# Altium schematic sheet TPS62082.SchDoc
size Letter; Author: FF7 HD Remastered
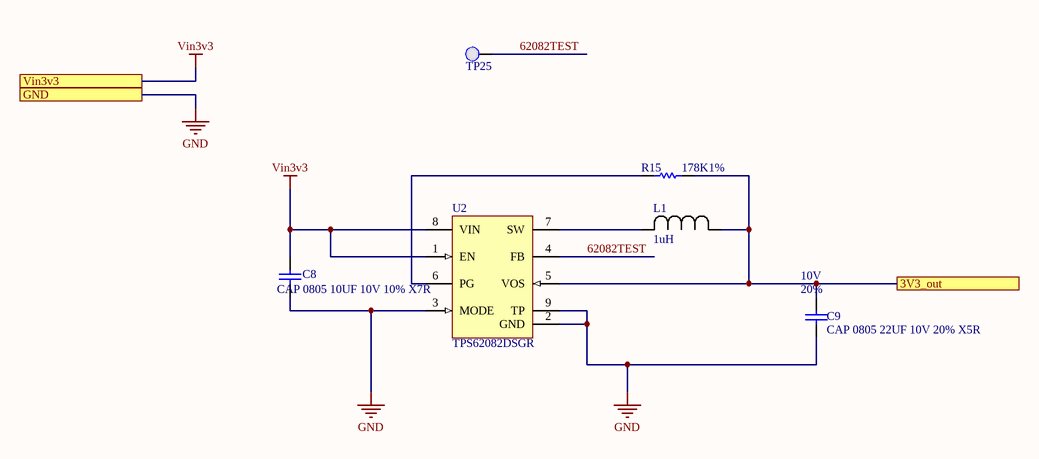
[diagram p0: TPS62082.SchDoc]

## Parts
C8  CAP 0805 10UF 10V 10% X7R  [0805_CAP]
C9  CAP 0805 22UF 10V 20% X5R  Tolerance: 20%  Voltage: 10V  [0805_CAP_60H]
L1  1uH  [IND_16100_WRE]
R15  value 178K  Tolerance: 1%  [0402_RES]  (hidden comment: RES 0402 178K 1%)
TP25  Test Point 0.1"  [Test Point 0.1"-Footprint-1]  (value not drawn)  (no BOM)
U2  TPS62082DSGR  [DSG0008A_V]

## Ports
3V3_out, GND, Vin3v3

## Nets
GND: C8.1 C9.1 U2.2(GND) U2.3(MODE) U2.9(TP) ; port GND
Vin3v3: C8.2 U2.1(EN) U2.8(VIN) ; port Vin3v3
3V3_out: C9.2 L1.1 R15.2 U2.5(VOS) ; port 3V3_out
62082TEST: TP25.1(PAD) U2.4(FB)
NetL1_2: L1.2 U2.7(SW)
NetR15_1: R15.1 U2.6(PG)

## Notes on the sheet
- Title:
- Desc:
- Size:
- Letter
- Auth:
- Proj:
- Sheet
- of
- www.seas.upenn.edu
- Electrical and Systems Engineering

## Library data of the parts
C8 = CMP-011-000478-1: Capacitor Surface Mount 0805 Footprint 10UF 10V 10% Tolerance Ceramic X7R; Manufacturer: Various; Description in Visual: Cap SMT 0805 10UF 10V 10%  Cer X7R; PCB Package: 0805; Type: Ceramic X7R; P/N: CAP 0805 10UF 10V 10% X7R; Manufacturer P/N: CAP 0805 10UF 10V 10% X7R; Mount: SMT
C9 = CMP-011-000507-1: Capacitor Surface Mount 0805 Footprint 22UF 10V 20% Tolerance Ceramic X5R; Manufacturer: Various; PCB Package: 0805; Description in Visual: Cap SMT 0805 22UF 10V 20%  Cer X5R; Value: 22UF; P/N: CAP 0805 22UF 10V 20% X5R; Manufacturer P/N: CAP 0805 22UF 10V 20% X5R; Mount: SMT; Type: Ceramic X5R
L1 = 744316100: No Description Available; Mfr_Name: Wurth Electronics
R15 = CMP-005-000504-3: Resistor Surface Mount, 178K Ohms, 0402 Footprint, 1% Tolerance 0.063W; Manufacturer: Various; PCB Package: 0402; Description in Visual: Res SMT 178K 0402  1%  0.063W; Mount: SMT; Manufacturer P/N: RES 0402 178K 1%; Power Rating: 0.063W
TP25 = CMP-00086-1
U2 = CMP-0323-00344-3: Buck Step Down Regulator with 2.3 to 6 V Input and 3.3 V Output, -40 to 85 degC, 8-Pin WSON (DSG), Green (RoHS & no Sb/Br); Manufacturer: Texas Instruments; Switch Current Limit(Typ)(A): 2.4; Vin(Min)(V): 2.3; Iq(Typ)(mA): 0.006; Regulated Outputs(#): 1; Vout(Max)(V): 3.3; Duty Cycle(Max)(%): 100; Iout(Max)(A): 1.2; SubFamily: Step-Down Regulator; Rating: Catalog; Vin(Max)(V): 6; ComponentLink1Description: Datasheet; ComponentLink3Description: URL Link1; ComponentLink2URL: http://www.ti.com/litv/pdf/mpds308a; DatasheetVersion: SLVSAE8B; PackageVersion: revB, Oct-2010; Eco-Plan: Green (RoHS & no Sb/Br); ComponentLink2Description: Package Specification; PackageReference: DSG0008A; Code_JEDEC: MO-229; Topology: Buck; PartNumber: TPS62082DSGR; PackageDescription: 8-Pin Plastic Small Outline No-Lead, 2 x 2 x 0.8 mm Body, 0.5 mm Pitch, Exposed Pad; ComponentLink1URL: http://www.ti.com/general/docs/lit/getliterature.tsp?genericPartNumber=TPS62082&fileType=pdf; ComponentLink3URL: Samples URL:http://www.ti.com/product/tps62082#samples; Vout(Min)(V): 3.3; Mounting Technology: Surface Mount